# EAGLE design ThunderBolt Lora (EAGLE 9.5.2)
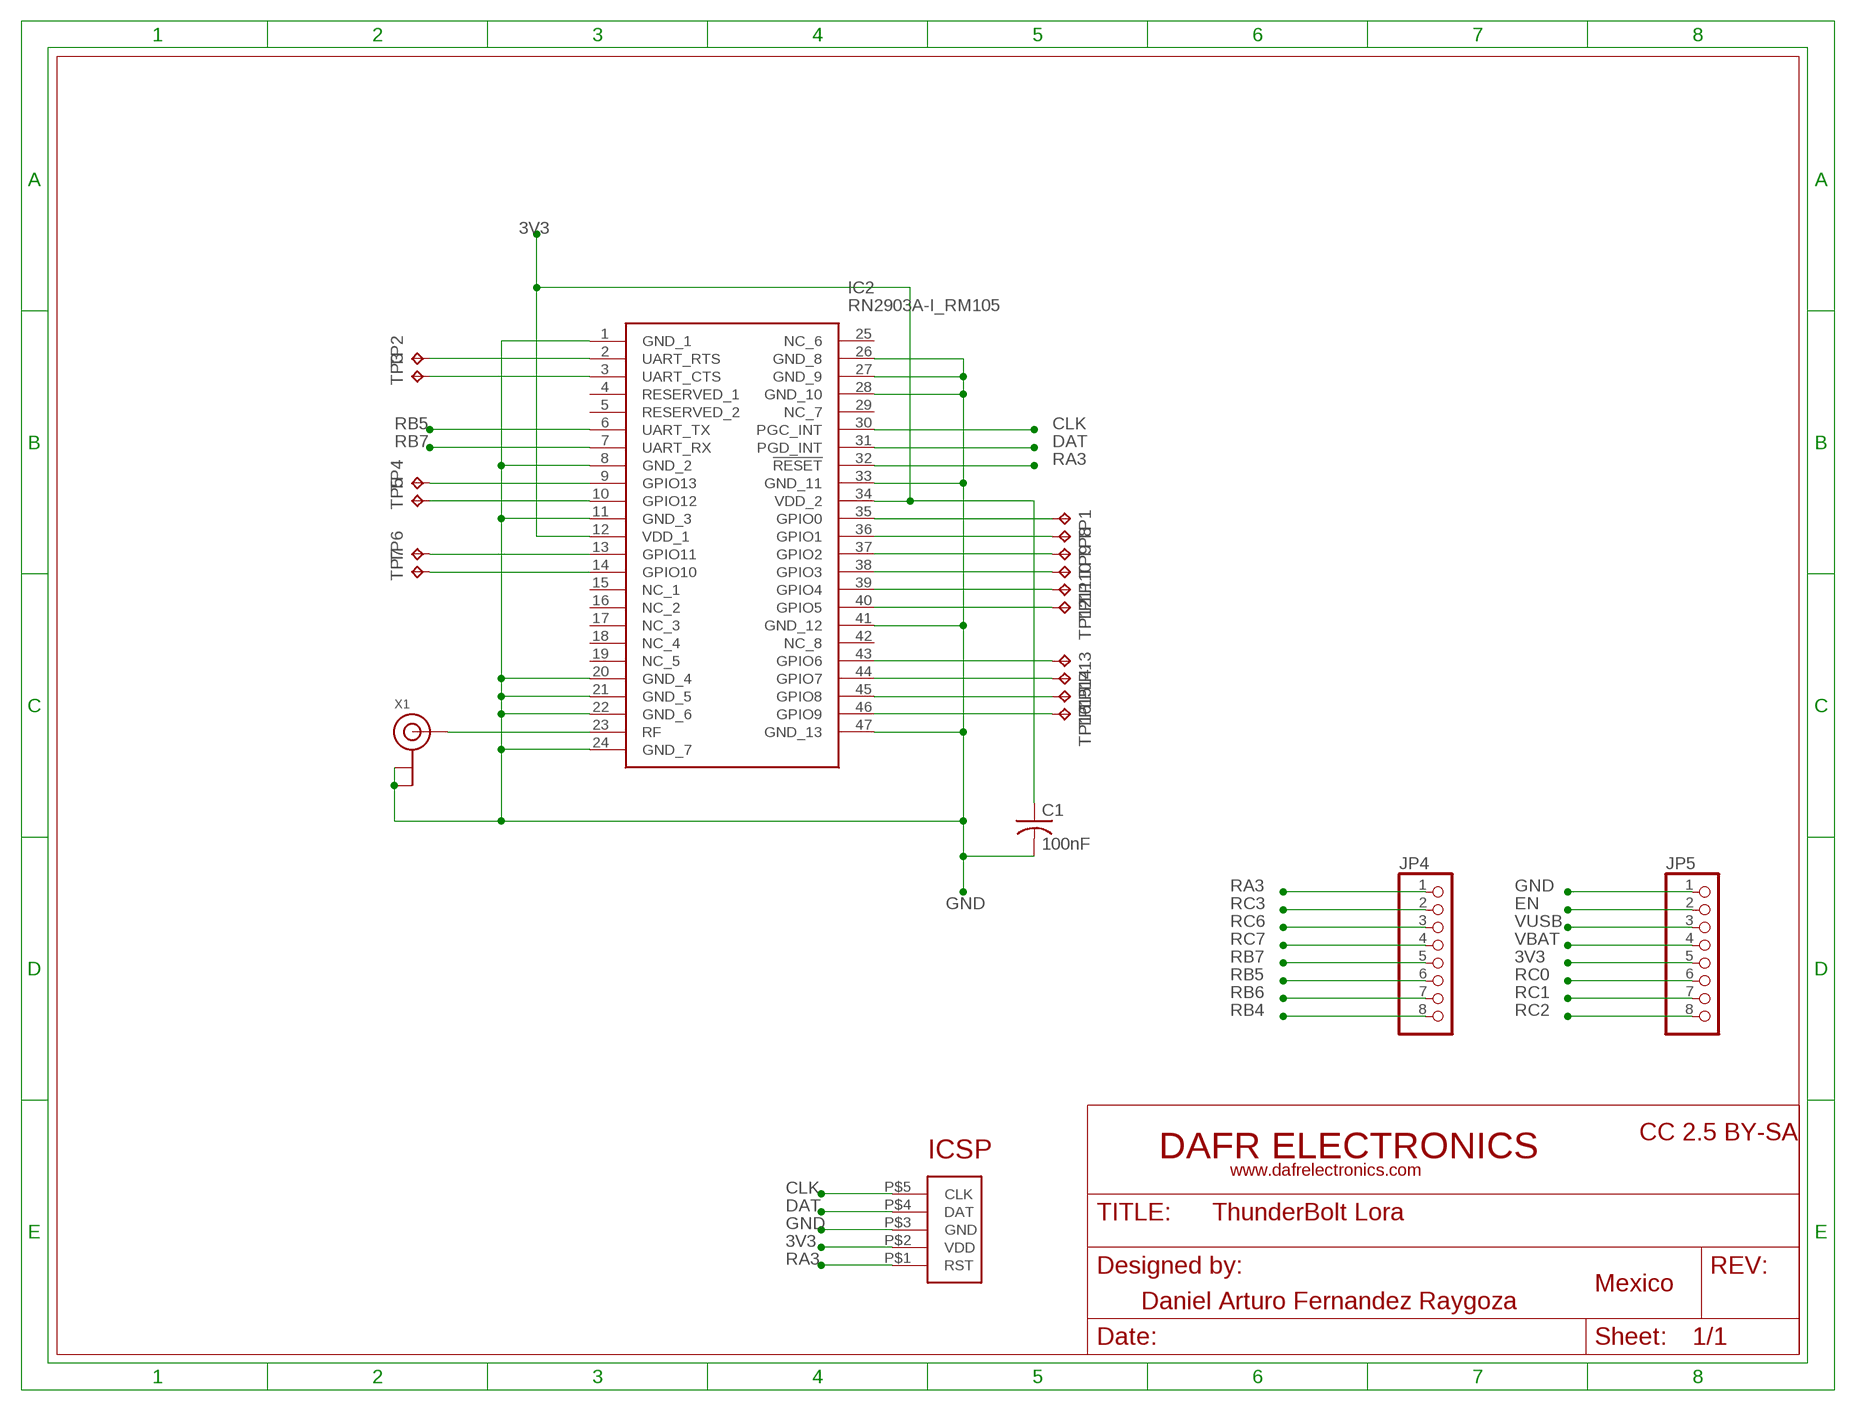
[diagram p0: schematic, sheet 1]

## Parts
C1  100nF  C-USC0603K  [C0603K]
IC2  RN2903A-I_RM105  [RN2903AIRM105]
JP4  PINHD-1X8BIG  [1X08-BIG]
JP5  PINHD-1X8BIG  [1X08-BIG]
TP1  TPB1,27  [B1,27]
TP2  TPB1,27  [B1,27]
TP3  TPB1,27  [B1,27]
TP4  TPB1,27  [B1,27]
TP5  TPB1,27  [B1,27]
TP6  TPB1,27  [B1,27]
TP7  TPB1,27  [B1,27]
TP8  TPB1,27  [B1,27]
TP9  TPB1,27  [B1,27]
TP10  TPB1,27  [B1,27]
TP11  TPB1,27  [B1,27]
TP12  TPB1,27  [B1,27]
TP13  TPB1,27  [B1,27]
TP14  TPB1,27  [B1,27]
TP15  TPB1,27  [B1,27]
TP16  TPB1,27  [B1,27]
U$2  ICSP_POGO  [ICSP_POGO]
X1  ANTENNA_U.FL  [U.FL]

## Nets
3V3: C1.1 IC2.12(VDD_1) IC2.34(VDD_2) JP5.5 U$2.P$2(VDD)
CLK: IC2.30(PGC_INT) U$2.P$5(CLK)
DAT: IC2.31(PGD_INT) U$2.P$4(DAT)
EN: JP5.2
GND: C1.2 IC2.1(GND_1) IC2.8(GND_2) IC2.11(GND_3) IC2.20(GND_4) IC2.21(GND_5) IC2.22(GND_6) IC2.24(GND_7) IC2.26(GND_8) IC2.27(GND_9) IC2.28(GND_10) IC2.33(GND_11) IC2.41(GND_12) IC2.47(GND_13) JP5.1 U$2.P$3(GND) X1.1(GND) X1.2(GND)
N$1: IC2.2(UART_RTS) TP2.TP
N$2: IC2.3(UART_CTS) TP3.TP
N$3: IC2.9(GPIO13) TP4.TP
N$4: IC2.10(GPIO12) TP5.TP
N$5: IC2.23(RF) X1.3(SIGNAL)
N$6: IC2.13(GPIO11) TP6.TP
N$7: IC2.14(GPIO10) TP7.TP
N$8: IC2.35(GPIO0) TP1.TP
N$9: IC2.46(GPIO9) TP16.TP
N$10: IC2.45(GPIO8) TP15.TP
N$11: IC2.44(GPIO7) TP14.TP
N$12: IC2.43(GPIO6) TP13.TP
N$13: IC2.40(GPIO5) TP12.TP
N$14: IC2.39(GPIO4) TP11.TP
N$15: IC2.38(GPIO3) TP10.TP
N$16: IC2.37(GPIO2) TP9.TP
N$17: IC2.36(GPIO1) TP8.TP
RA3: IC2.32(!RESET) JP4.1 U$2.P$1(RST)
RB4: JP4.8
RB5: IC2.6(UART_TX) JP4.6
RB6: JP4.7
RB7: IC2.7(UART_RX) JP4.5
RC0: JP5.6
RC1: JP5.7
RC2: JP5.8
RC3: JP4.2
RC6: JP4.3
RC7: JP4.4
VBAT: JP5.4
VUSB: JP5.3
Unconnected: IC2.4(RESERVED_1) IC2.5(RESERVED_2) IC2.15(NC_1) IC2.16(NC_2) IC2.17(NC_3) IC2.18(NC_4) IC2.19(NC_5) IC2.25(NC_6) IC2.29(NC_7) IC2.42(NC_8)

## Library data of the parts
C1 = adafruit:C-US: CAPACITOR, American symbol
IC2 = SamacSys_Parts:RN2903A-I_RM105: MICROCHIP - RN2903A-I/RM105 - TRANSCEIVER MODULE, 300KBPS, 928MHZ Source: Datasheet <https://componentsearchengine.com/Datasheets/1/RN2903A-I_RM105.pdf>; DESCRIPTION: MICROCHIP - RN2903A-I/RM105 - TRANSCEIVER MODULE, 300KBPS, 928MHZ; HEIGHT: 3.34mm; MANUFACTURER_NAME: Microchip; MANUFACTURER_PART_NUMBER: RN2903A-I/RM105; MOUSER_PART_NUMBER: 579-RN2903A-I/RM105; MOUSER_PRICE-STOCK: https://www.mouser.com/Search/Refine.aspx?Keyword=579-RN2903A-I%2FRM105
JP4 JP5 = adafruit:PINHD-1X8: PIN HEADER
TP1-TP16 = testpad:TP: Test pad
U$2 = ICSP_POGO:ICSP_POGO
X1 = adafruit:ANTENNA_U.FL: U.FL Antenna Connector

## Board
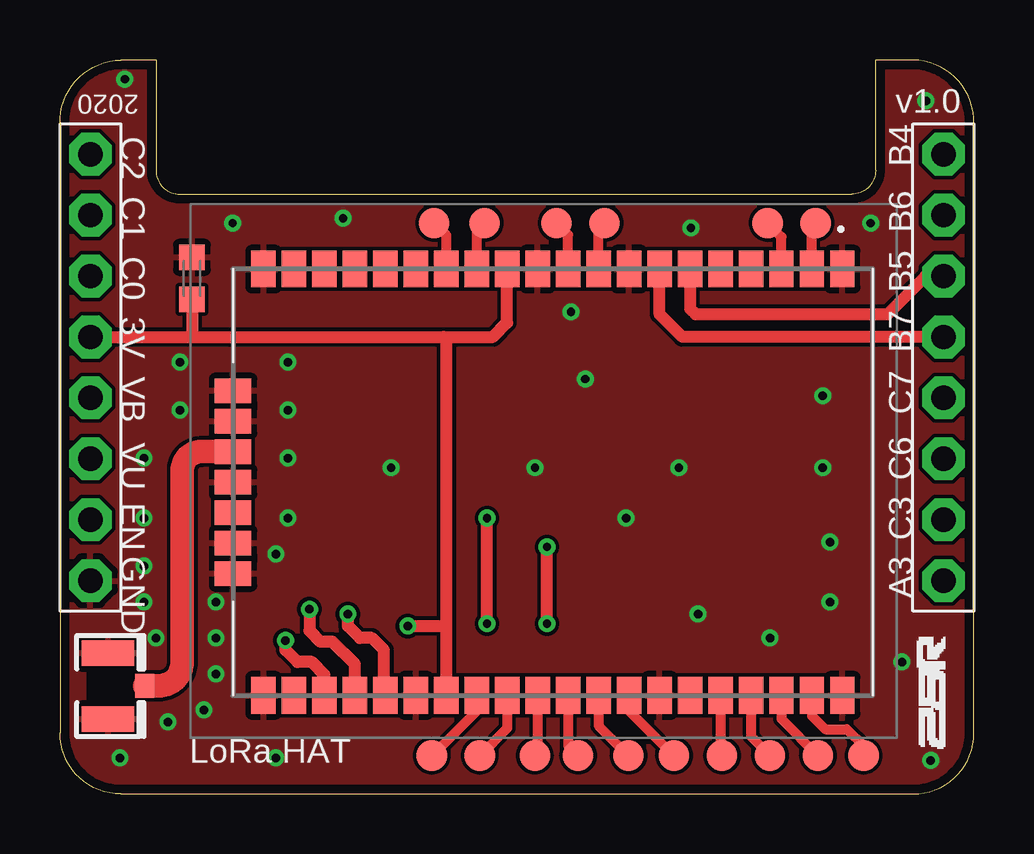
[diagram p1: board, top side]
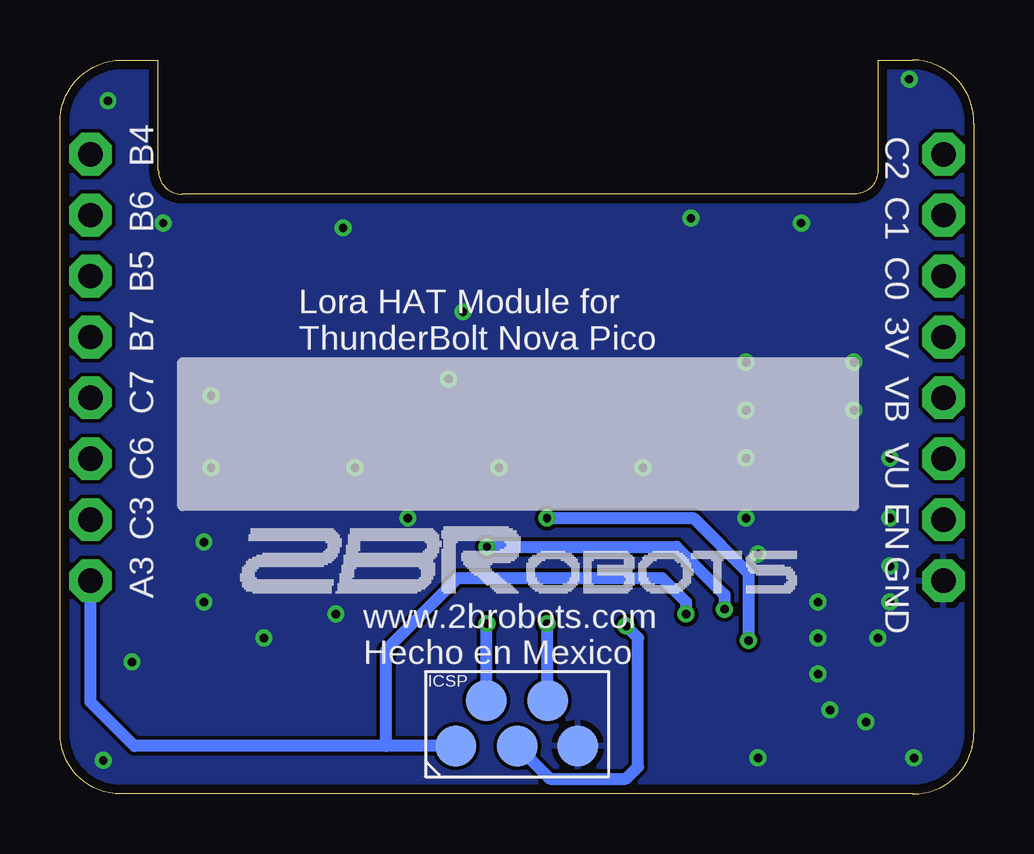
[diagram p2: board, bottom side, seen from below]

Size 38.1 x 30.6 mm. Coordinates in mm from the lower left corner, seen from the top.
Outline: 2.54,0 35.56,0 arc90 38.1,2.54 38.1,27.94 arc90 35.56,30.6 34,30.6 34,26 arc-90 33,25 5,25 arc-90 4,26 4,30.6 2.54,30.6 arc90 0,27.94 0,2.54 arc90 2.54,0
Copper layers (1*16): Top 0.0356mm / dielectric 1.5011mm / Bottom 0.0356mm
Design rules "2brobots-2layer": minimum track width 6mil, minimum drill 0.3mm, track to track 6mil, track to pad 6mil, pad to pad 6mil, via to via 6mil, smd to smd 6mil, copper to edge 15mil, drill to drill 6mil, minimum pad ring 7mil, minimum via ring 7mil, stop-mask expansion 2.5mil, vias tented up to drill 50mil, thermal gap 10mil

### Footprints (pad centres in the part's own frame; a part is rotated, then mirrored left to right if it is on the bottom)
C0603K = smd 1.05 x 1.08: 1 -0.875,0; 2 0.875,0
RN2903AIRM105 = smd 1.524 x 1.016: 1 8.89,-12.065; 2 8.89,-10.795; 3 8.89,-9.525; 4 8.89,-8.255; 5 8.89,-6.985; 6 8.89,-5.715; 7 8.89,-4.445; 8 8.89,-3.175; 9 8.89,-1.905; 10 8.89,-0.635; 11 8.89,0.635; 12 8.89,1.905; 13 8.89,3.175; 14 8.89,4.445; 15 8.89,5.715; 16 8.89,6.985; 17 8.89,8.255; 18 8.89,9.525; 19 8.89,10.795; 20 8.89,12.065; 28 -8.89,12.065; 29 -8.89,10.795; 30 -8.89,9.525; 31 -8.89,8.255; 32 -8.89,6.985; 33 -8.89,5.715; 34 -8.89,4.445; 35 -8.89,3.175; 36 -8.89,1.905; 37 -8.89,0.635; 38 -8.89,-0.635; 39 -8.89,-1.905; 40 -8.89,-3.175; 41 -8.89,-4.445; 42 -8.89,-5.715; 43 -8.89,-6.985; 44 -8.89,-8.255; 45 -8.89,-9.525; 46 -8.89,-10.795; 47 -8.89,-12.065 | smd 1.016 x 1.524: 21 3.81,13.335; 22 2.54,13.335; 23 1.27,13.335; 24 0,13.335; 25 -1.27,13.335; 26 -2.54,13.335; 27 -3.81,13.335
1X08-BIG = drill 1.016 pad 1.778 octagon: 1 -8.89,0; 2 -6.35,0; 3 -3.81,0; 4 -1.27,0; 5 1.27,0; 6 3.81,0; 7 6.35,0; 8 8.89,0
B1,27 = smd 1.27 x 1.27: TP 0,0
ICSP_POGO = smd 1.7 x 1.7: P$1 -2.55,0; P$2 0.01,0; P$3 2.54,0; P$4 -1.275,1.9; P$5 1.275,1.9
U.FL = smd 2.2 x 1.05: 1 0,1.375; 2 0,-1.375 | smd 0.8 x 1: 3 1.525,0

### Placement (x,y rotation side)
C1  5.5,21.5 90 top
IC2  20.55,13 90 top
JP4  36.83,17.78 90 top
JP5  1.27,17.78 90 top
TP1  15.5,1.6 0 top
TP2  31.5,23.8 0 top
TP3  29.5,23.8 0 top
TP4  22.7,23.8 0 top
TP5  20.7,23.8 0 top
TP6  17.7,23.8 0 top
TP7  15.6,23.8 0 top
TP8  17.5,1.6 0 top
TP9  19.8,1.6 0 top
TP10  21.6,1.6 0 top
TP11  23.7,1.6 0 top
TP12  25.6,1.6 0 top
TP13  27.6,1.6 0 top
TP14  29.6,1.6 0 top
TP15  31.6,1.6 0 top
TP16  33.5,1.6 0 top
U$2  19.05,2 0 bottom
X1  2,4.5 0 top

### Tracks (layer width: path | path; a pad name or v marks a point on that pad's centre or on a via)
3V3  (via drill 0.35)
  Top 0.508: JP5.5 5.5,19.05 | 5.5,19.05 16,19.05 | 16,19.05 18.05,19.05 18.64,19.64 IC2.12 | IC2.34 16.11,7 | 16.11,7 16.11,18.95 16,19.05 | C1.1 5.5,19.05 | v14.5,7 16.11,7
  Bottom 0.508: U$2.P$2 17.68,0.64 14.5,0.64 14,1.14 14,6.5 v14.5,7
CLK  (via drill 0.35)
  Top 0.508: v17.8,7.1 v17.8,11.5 | IC2.30 11.03,4.97 10.5,5.5 9.9,5.5 9.4,6 v9.4,6.4
  Bottom 0.508: U$2.P$5 17.77,7.08 v17.8,7.1 | v17.8,11.5 11.7,11.5 9.4,9.2 v9.4,6.4
DAT  (via drill 0.35)
  Top 0.508: v10.4,7.7 10.4,6.8 10.85,6.35 11.35,6.35 12.29,5.41 IC2.31 | v20.3,7.1 v20.3,10.3
  Bottom 0.508: U$2.P$4 20.32,7.1 v20.3,7.1 | v10.4,7.7 10.4,8.3 12.4,10.3 v20.3,10.3
GND  (via drill 0.35)
  other vias: 36.3,1.4 32.1,8 36.1,28.9 21.9,17.3 7.2,23.8 13.8,13.6 11.8,24 33.8,23.8 4.5,3 6,3.5 6.5,5 6.5,6.5 6.5,8 9.5,11.5 9.5,16 9.5,14 9.5,18 5,18 5,16 19.8,13.6 25.8,13.6 31.8,13.6 31.8,16.6 21.3,20.1 32.1,10.5 26.6,7.5 29.6,6.5 35.1,5.5 9,1.5 3.5,14 3.5,11.5 3.5,9.5 3.5,8 9,10 4,6.5 2.5,1.5 23.6,11.5 26.3,23.6 2.7,29.8
  pour Bottom: 0,30.48 0,0 38.1,0 38.1,30.48
  pour Top: 0,30.48 0,0 38.1,0 38.1,30.48
N$1
  Top 0.406: IC2.2 31.34,23.64 TP2.TP
N$2
  Top 0.406: IC2.3 30.07,23.23 TP3.TP
N$3
  Top 0.406: IC2.9 22.45,23.55 TP4.TP
N$4
  Top 0.406: IC2.10 21.18,23.32 TP5.TP
N$5
  Top 0.989: X1.3 4.1,4.5 arc90 5.1,5.5 5.1,13.5 arc-90 5.87,14.27 IC2.23
N$6
  Top 0.406: IC2.13 17.38,23.48 TP6.TP
N$7
  Top 0.406: IC2.14 16.11,23.3 TP7.TP
N$8
  Top 0.406: IC2.35 17.38,3.48 TP1.TP
N$9
  Top 0.406: IC2.46 31.34,3.25 31.9,2.7 32.8,2.7 33.5,2 TP16.TP
N$10
  Top 0.406: IC2.45 30.07,3.12 TP15.TP
N$11
  Top 0.406: IC2.44 28.8,2.4 TP14.TP
N$12
  Top 0.406: IC2.43 27.54,1.67 TP13.TP
N$13
  Top 0.406: IC2.40 23.73,3.48 TP12.TP
N$14
  Top 0.406: IC2.39 22.45,2.85 TP11.TP
N$15
  Top 0.406: IC2.38 21.18,2.02 TP10.TP
N$16
  Top 0.406: IC2.37 19.91,1.72 TP9.TP
N$17
  Top 0.406: IC2.36 18.64,2.75 TP8.TP
RA3  (via drill 0.35)
  Top 0.508: v12,7.5 12,7 12.5,6.5 13,6.5 13.5,6 13.5,4.17 IC2.32
  Bottom 0.508: U$2.P$1 24.5,2 | 24.5,2 35,2 36.83,3.83 JP4.1 | 24.5,2 24.5,6 21.5,9 13,9 12,8 v12,7.5
RB5
  Top 0.508: IC2.6 26.27,20.23 26.5,20 34.5,20 36.09,21.59 JP4.6
RB7
  Top 0.508: JP4.5 25.95,19.05 25,20 IC2.7

### Text on the board
tPlace: 2020 | v1.0 | B4 | C2 | C1 | B6 | B5 | C0 | 3V | B7 | C7 | VB | VU | C6 | EN | C3 | GND | A3 | LoRa HAT
bPlace: B4 | C2 | C1 | B6 | B5 | C0 | 3V | B7 | Lora HAT Module for / ThunderBolt Nova Pico | C7 | VB | VU | C6 | EN | C3 | GND | A3 | www.2brobots.com | Hecho en Mexico